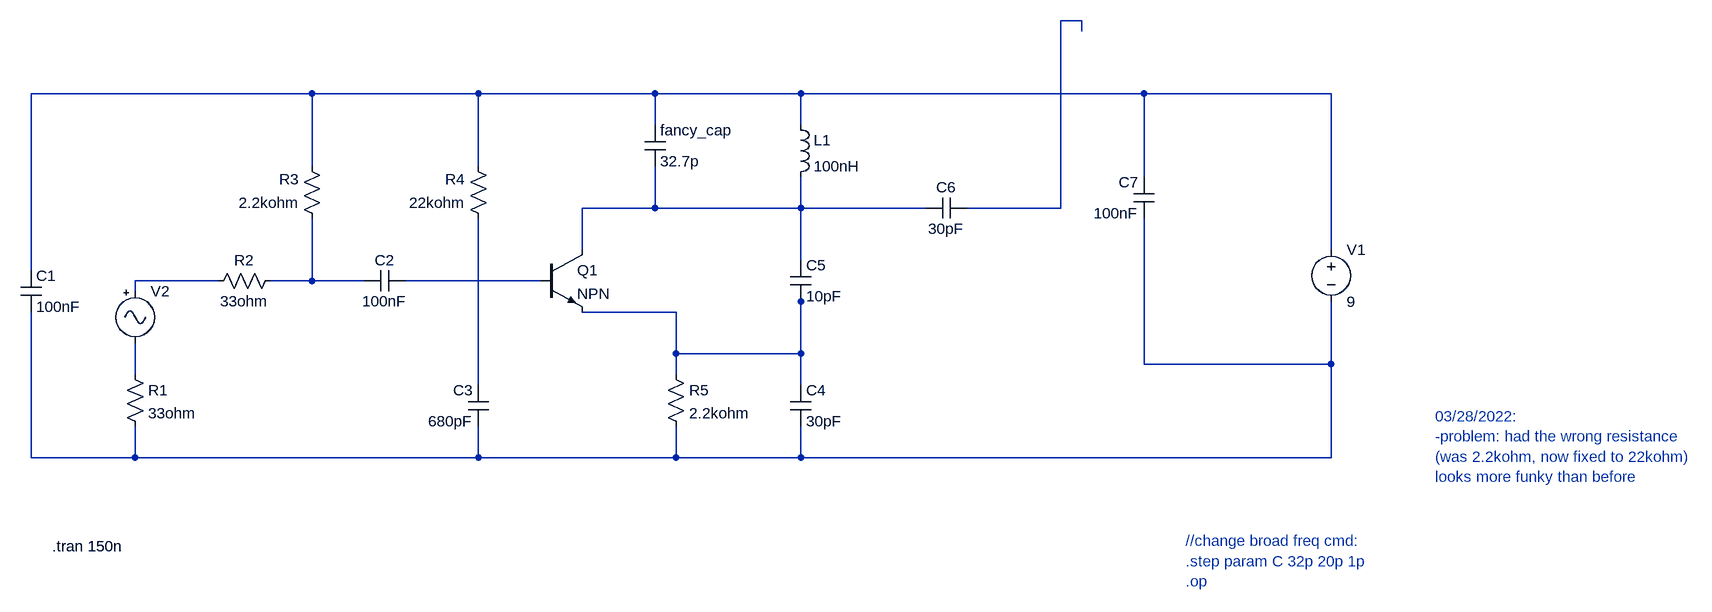
[diagram p0: schematic fm_1.asc]
fm_1.asc, the LTspice schematic file:
Version 4
SHEET 1 2772 680
WIRE 1632 -240 1600 -240
WIRE 1632 -224 1632 -240
WIRE 448 -128 16 -128
WIRE 704 -128 448 -128
WIRE 976 -128 704 -128
WIRE 1200 -128 976 -128
WIRE 1728 -128 1200 -128
WIRE 2016 -128 1728 -128
WIRE 976 -80 976 -128
WIRE 1200 -80 1200 -128
WIRE 448 -16 448 -128
WIRE 704 -16 704 -128
WIRE 1728 0 1728 -128
WIRE 976 48 976 -16
WIRE 976 48 864 48
WIRE 1200 48 1200 0
WIRE 1200 48 976 48
WIRE 1392 48 1200 48
WIRE 1600 48 1600 -240
WIRE 1600 48 1456 48
WIRE 864 112 864 48
WIRE 2016 112 2016 -128
WIRE 1200 128 1200 48
WIRE 16 144 16 -128
WIRE 304 160 176 160
WIRE 448 160 448 64
WIRE 448 160 384 160
WIRE 528 160 448 160
WIRE 800 160 592 160
WIRE 176 176 176 160
WIRE 1200 192 1200 176
WIRE 1008 208 864 208
WIRE 1008 272 1008 208
WIRE 1200 272 1200 192
WIRE 1200 272 1008 272
WIRE 1728 288 1728 64
WIRE 2016 288 2016 192
WIRE 2016 288 1728 288
WIRE 176 304 176 256
WIRE 1008 304 1008 272
WIRE 704 320 704 64
WIRE 1200 320 1200 272
WIRE 16 432 16 208
WIRE 176 432 176 384
WIRE 176 432 16 432
WIRE 704 432 704 384
WIRE 704 432 176 432
WIRE 1008 432 1008 384
WIRE 1008 432 704 432
WIRE 1200 432 1200 384
WIRE 1200 432 1008 432
WIRE 2016 432 2016 288
WIRE 2016 432 1200 432
SYMBOL cap 0 144 R0
SYMATTR InstName C1
SYMATTR Value 100nF
SYMBOL res 160 288 R0
SYMATTR InstName R1
SYMATTR Value 33ohm
SYMBOL cap 592 144 R90
WINDOW 0 0 32 VBottom 2
WINDOW 3 32 32 VTop 2
SYMATTR InstName C2
SYMATTR Value 100nF
SYMBOL cap 720 384 R180
WINDOW 0 24 56 Left 2
WINDOW 3 24 8 Left 2
SYMATTR InstName C3
SYMATTR Value 680pF
SYMBOL res 400 144 R90
WINDOW 0 0 56 VBottom 2
WINDOW 3 32 56 VTop 2
SYMATTR InstName R2
SYMATTR Value 33ohm
SYMBOL res 464 80 R180
WINDOW 0 36 76 Left 2
WINDOW 3 36 40 Left 2
SYMATTR InstName R3
SYMATTR Value 2.2kohm
SYMBOL res 720 80 R180
WINDOW 0 36 76 Left 2
WINDOW 3 36 40 Left 2
SYMATTR InstName R4
SYMATTR Value 22kohm
SYMBOL npn 800 112 R0
SYMATTR InstName Q1
SYMBOL res 992 288 R0
SYMATTR InstName R5
SYMATTR Value 2.2kohm
SYMBOL cap 1184 320 R0
SYMATTR InstName C4
SYMATTR Value 30pF
SYMBOL cap 1184 128 R0
SYMATTR InstName C5
SYMATTR Value 10pF
SYMBOL cap 1456 32 R90
WINDOW 0 0 32 VBottom 2
WINDOW 3 32 32 VTop 2
SYMATTR InstName C6
SYMATTR Value 30pF
SYMBOL cap 1744 64 R180
WINDOW 0 24 56 Left 2
WINDOW 3 24 8 Left 2
SYMATTR InstName C7
SYMATTR Value 100nF
SYMBOL voltage 2016 96 R0
WINDOW 123 0 0 Left 0
WINDOW 39 0 0 Left 0
SYMATTR InstName V1
SYMATTR Value 9
SYMBOL ind 1184 -96 R0
SYMATTR InstName L1
SYMATTR Value 100nH
SYMBOL Misc\\signal 176 160 R0
WINDOW 3 24 44 Left 2
WINDOW 123 0 0 Left 0
WINDOW 39 0 0 Left 0
SYMATTR Value ""
SYMATTR InstName V2
SYMBOL cap 960 -80 R0
SYMATTR InstName fancy_cap
SYMATTR Value 32.7p
TEXT 48 568 Left 2 !.tran 150n
TEXT 1792 560 Left 2 ;//change broad freq cmd:\n.step param C 32p 20p 1p\n.op
TEXT 2176 368 Left 2 ;03/28/2022:\n-problem: had the wrong resistance \n(was 2.2kohm, now fixed to 22kohm)\nlooks more funky than before

The netlist it stands for:
* fm_1.asc
C1 N002 N008 100nF
R1 N009 N008 33ohm
C2 N006 N005 100nF
C3 N008 N010 680pF
R2 N005 N004 33ohm
R3 N005 N002 2.2kohm
R4 N010 N002 22kohm
Q1 N003 N006 N007 0 NPN
R5 N007 N008 2.2kohm
C4 N007 N008 30pF
C5 N003 N007 10pF
C6 N001 N003 30pF
C7 N008 N002 100nF
V1 N002 N008 9
L1 N002 N003 100nH
V2 N004 N009
C§fancy_cap N002 N003 32.7p
.model NPN NPN
.model PNP PNP
.lib standard.bjt
.tran 150n
* //change broad freq cmd:
* .step param C 32p 20p 1p
* .op
* 03/28/2022:
* -problem: had the wrong resistance
* (was 2.2kohm, now fixed to 22kohm)
* looks more funky than before
.backanno
.end